# Altium schematic sheet G2G-X Module.SchDoc: TITLE:
size 270 x 207 mm; Date: Date:; >LAST_DATE_TIME: 02/02/2015 14:18:43; Sheet:: Sheet:; >SHEET: 1; REV:: REV:; >DRAWING_NAME: G2G-X Module.sch; Released under the Creative Commons: Released under the Creative Commons; Attribution Share-Alike 4.0 License: Attribution Share-Alike 4.0 License; https://creativecommons.org/licenses/by-sa/4.0/: https://creativecommons.org/licenses/by-sa/4.0/; Design by:: Design by:; DESIGNER: Nobody; VERSION: v01
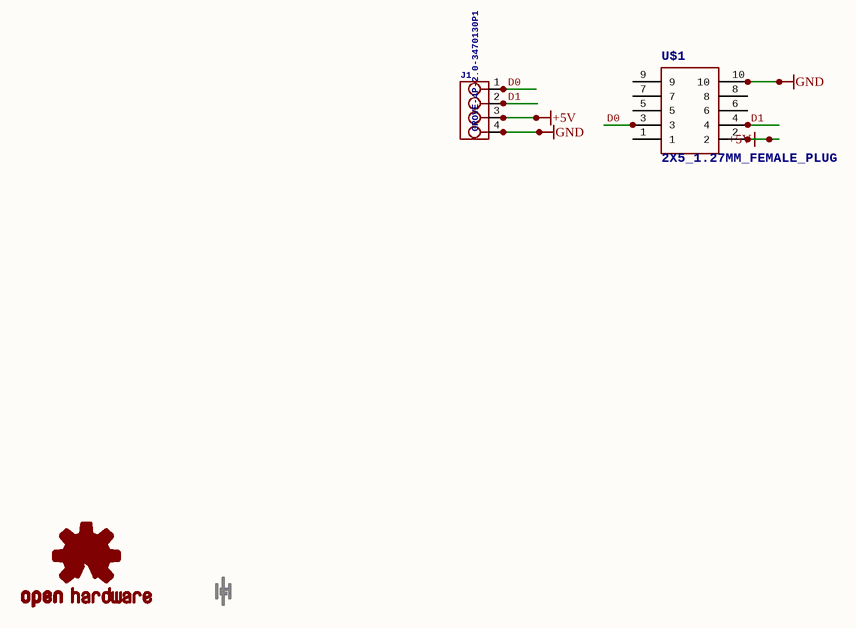
[diagram p0: G2G-X Module.SchDoc]

## Parts
J1  >NAME: J1  [4P-2.0]  (hidden comment: GROVE-4P-2.0-3470130P1)
LOGO1  OSHW-LOGOS  [OSHW-LOGO-S]  (value not drawn)
U$1  >NAME: U$1  [2X5_1.27MM_FEMALE_PLUG]  (hidden comment: 2X5_1.27MM_FEMALE_PLUG)
U$2  GADGETEER_LOGO_SMALL  [GADGETEER_LOGO_SMALL]  (value not drawn)

## Nets
+5V: J1.3 U$1.2
GND: J1.4 U$1.10
D0: J1.1 U$1.3
D1: J1.2 U$1.4

Not connected (* = marked no-connect by the designer): U$1 1 5 6 7 8 9

## Library data of the parts
LOGO1 = OSHW-LOGOS: <b>Open Source Hardware Logo</b> This logo indicates the piece of hardware it is found on incorporates a OSHW license and/or adheres to the definition of open source hardware found here: http://freedomdefined.org/OSHW
J1 = GROVE-4P-2.0-3470130P1: >VALUE: GROVE-4P-2.0-3470130P1
U$1 = 2X5_1.27MM_FEMALE_PLUG: >VALUE: 2X5_1.27MM_FEMALE_PLUG